# Altium schematic sheet sensorbreakout.schdoc: Core Module
size 431 x 279 mm; DrawnBy: D. Bruey, M. Ciuffo; Organization: Synapse Product Development, LLC.; Address1: 1511 6th Ave., Suite 400; Address2: Seattle, Washington 98101; Address3: 206.381.0898; Address4: www.synapse.com; DocumentNumber: 1; SheetNumber: 1; SheetTotal: 3; PageSetup: Record=PageOptions|CenterHorizontal=True|CenterVertical=True|PrintScale=1.06|XCorrection=1.00|YCorrection=1.00|PrintKind=1|BorderSize=5000000|LeftOffset=0|BottomOffset=0|Orientation=2|PaperLength=4318|PaperWidth=2794|Scale=100|PaperSource=7|PrintQuality=200|MediaType=1|DitherType=10|PrintScaleMode=1|PaperKind=11x17|PaperIndex=3
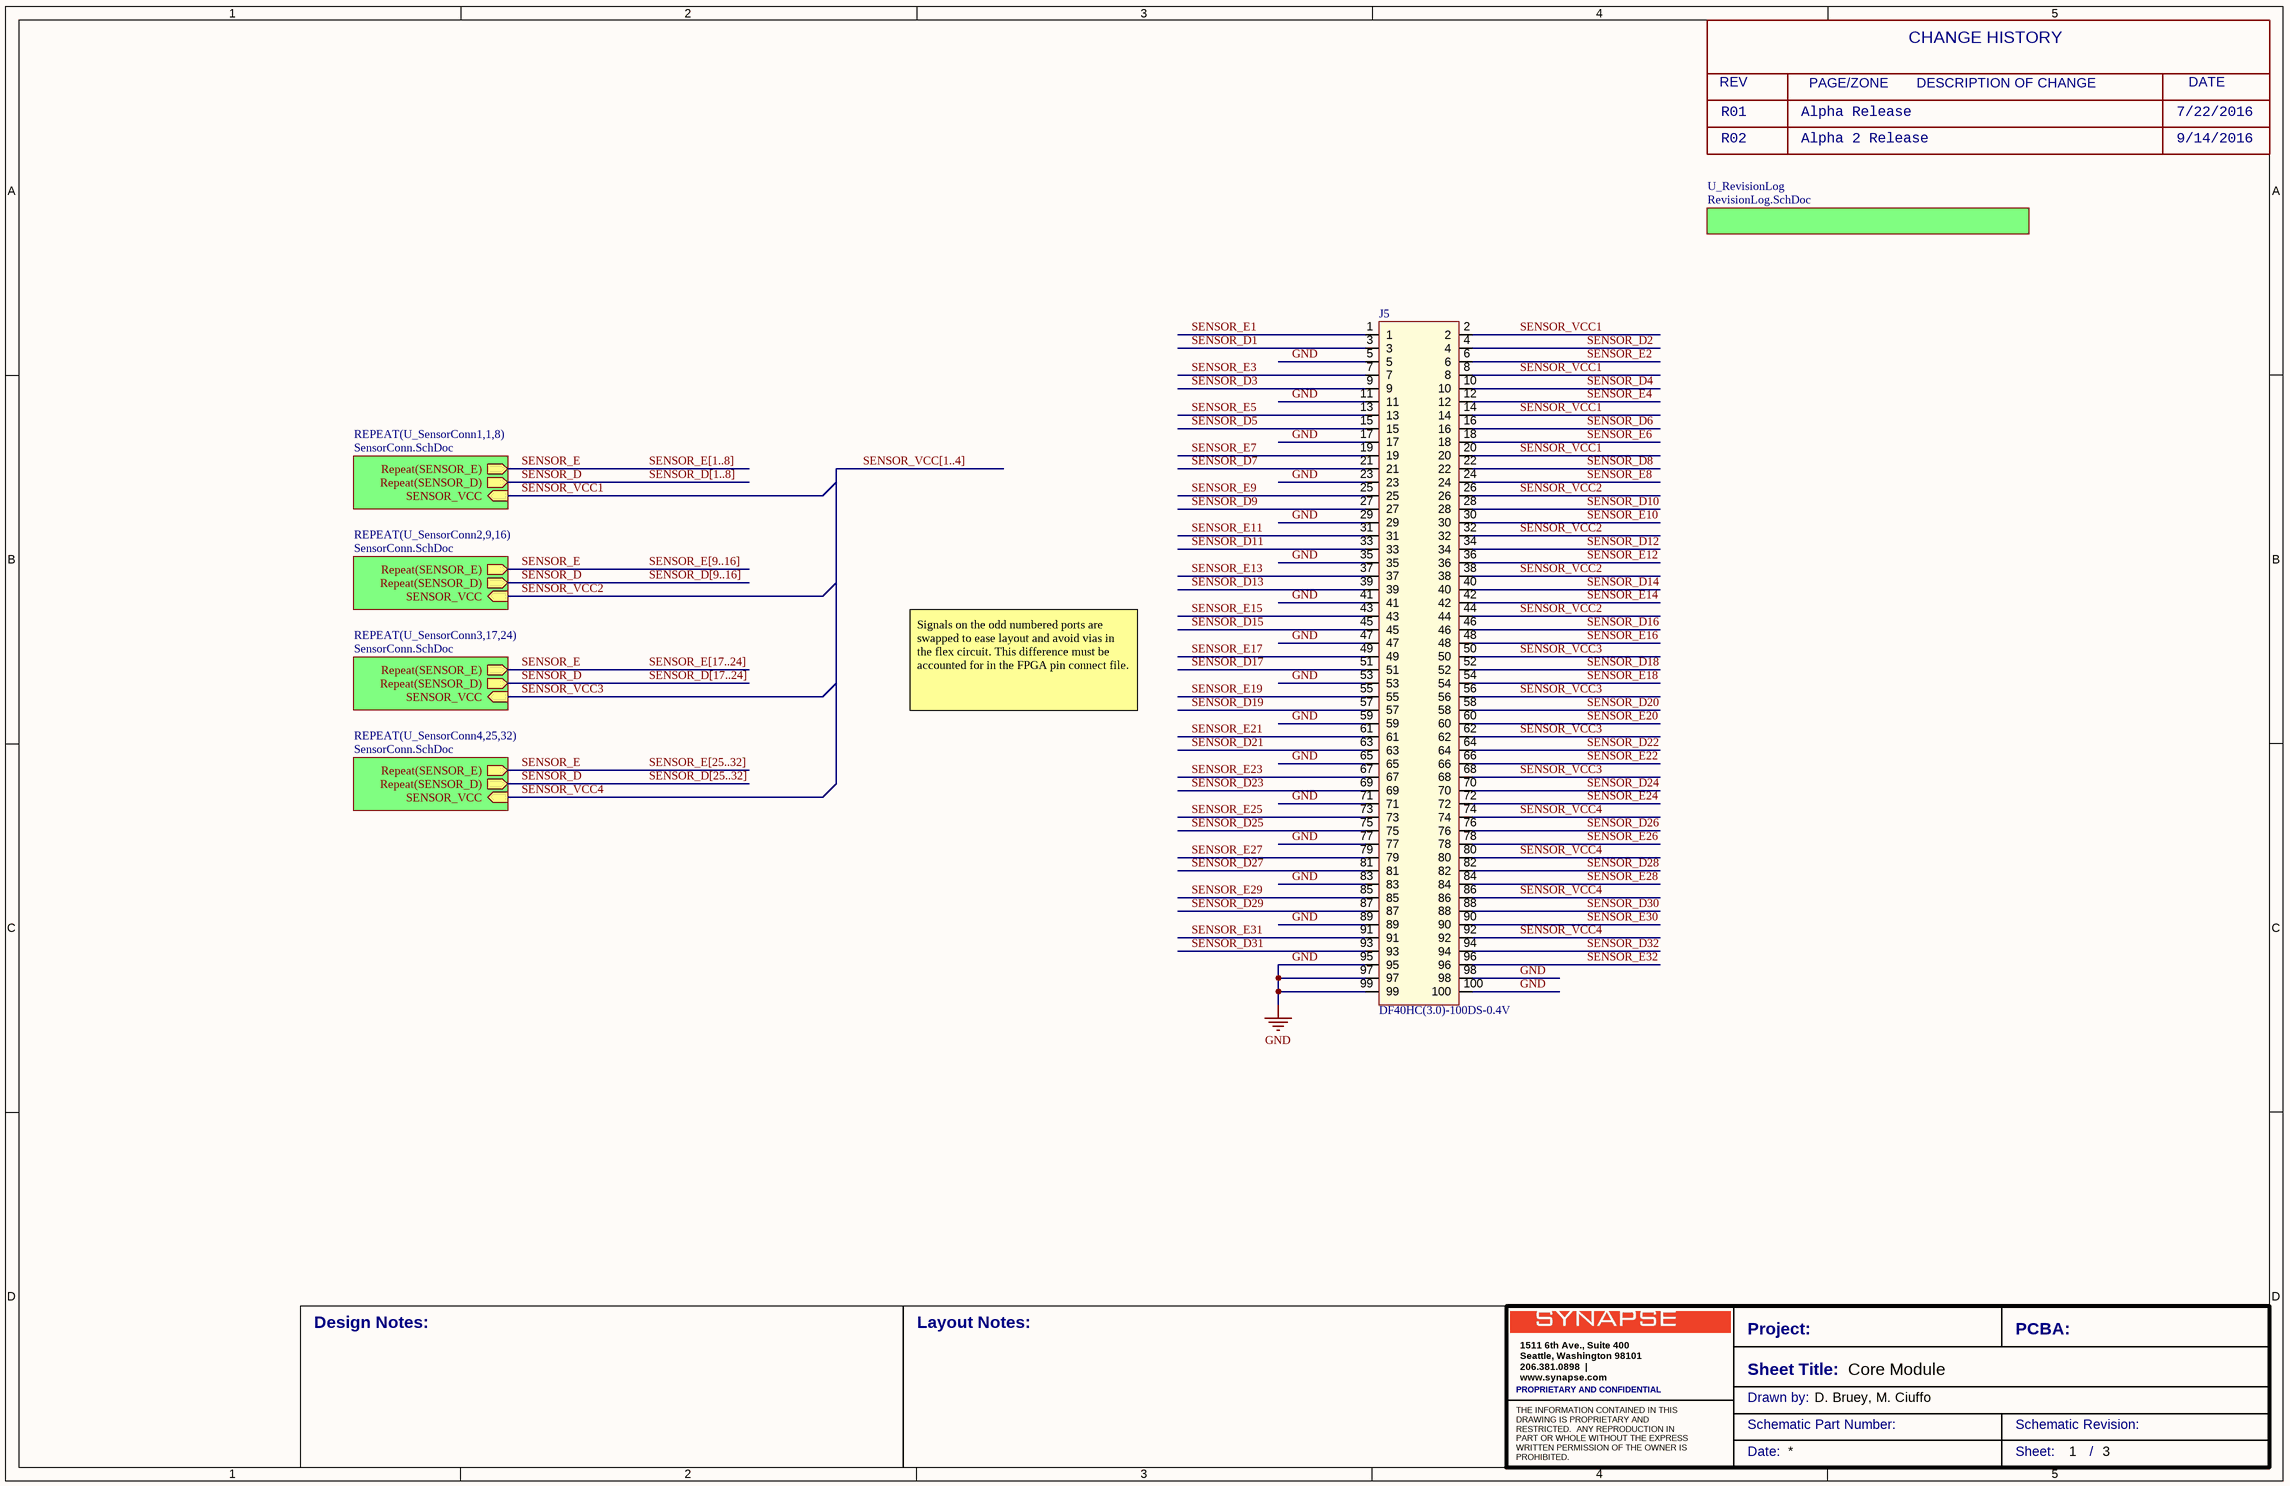
[diagram p0: sensorbreakout.schdoc]

## Parts
J5  DF40HC(3.0)-100DS-0.4V  [con100_hirose-df40c-100ds_129h]

## Sub-sheets
REPEAT(U_SensorConn1,1,8) = SensorConn.SchDoc: Repeat(SENSOR_D), Repeat(SENSOR_E), SENSOR_VCC (in)
REPEAT(U_SensorConn2,9,16) = SensorConn.SchDoc: Repeat(SENSOR_D), Repeat(SENSOR_E), SENSOR_VCC (in)
REPEAT(U_SensorConn3,17,24) = SensorConn.SchDoc: Repeat(SENSOR_D), Repeat(SENSOR_E), SENSOR_VCC (in)
REPEAT(U_SensorConn4,25,32) = SensorConn.SchDoc: Repeat(SENSOR_D), Repeat(SENSOR_E), SENSOR_VCC (in)
U_RevisionLog = RevisionLog.SchDoc: no entries

## Nets
GND: J5.5 J5.11 J5.17 J5.23 J5.29 J5.35 J5.41 J5.47 J5.53 J5.59 J5.65 J5.71 J5.77 J5.83 J5.89 J5.95 J5.97 J5.98 J5.99 J5.100
SENSOR_D: sheet REPEAT(U_SensorConn1,1,8)/Repeat(SENSOR_D), sheet REPEAT(U_SensorConn2,9,16)/Repeat(SENSOR_D), sheet REPEAT(U_SensorConn3,17,24)/Repeat(SENSOR_D), sheet REPEAT(U_SensorConn4,25,32)/Repeat(SENSOR_D)
SENSOR_D1: J5.3
SENSOR_D2: J5.4
SENSOR_D3: J5.9
SENSOR_D4: J5.10
SENSOR_D5: J5.15
SENSOR_D6: J5.16
SENSOR_D7: J5.21
SENSOR_D8: J5.22
SENSOR_D9: J5.27
SENSOR_D10: J5.28
SENSOR_D11: J5.33
SENSOR_D12: J5.34
SENSOR_D13: J5.39
SENSOR_D14: J5.40
SENSOR_D15: J5.45
SENSOR_D16: J5.46
SENSOR_D17: J5.51
SENSOR_D18: J5.52
SENSOR_D19: J5.57
SENSOR_D20: J5.58
SENSOR_D21: J5.63
SENSOR_D22: J5.64
SENSOR_D23: J5.69
SENSOR_D24: J5.70
SENSOR_D25: J5.75
SENSOR_D26: J5.76
SENSOR_D27: J5.81
SENSOR_D28: J5.82
SENSOR_D29: J5.87
SENSOR_D30: J5.88
SENSOR_D31: J5.93
SENSOR_D32: J5.94
SENSOR_E: sheet REPEAT(U_SensorConn1,1,8)/Repeat(SENSOR_E), sheet REPEAT(U_SensorConn2,9,16)/Repeat(SENSOR_E), sheet REPEAT(U_SensorConn3,17,24)/Repeat(SENSOR_E), sheet REPEAT(U_SensorConn4,25,32)/Repeat(SENSOR_E)
SENSOR_E1: J5.1
SENSOR_E2: J5.6
SENSOR_E3: J5.7
SENSOR_E4: J5.12
SENSOR_E5: J5.13
SENSOR_E6: J5.18
SENSOR_E7: J5.19
SENSOR_E8: J5.24
SENSOR_E9: J5.25
SENSOR_E10: J5.30
SENSOR_E11: J5.31
SENSOR_E12: J5.36
SENSOR_E13: J5.37
SENSOR_E14: J5.42
SENSOR_E15: J5.43
SENSOR_E16: J5.48
SENSOR_E17: J5.49
SENSOR_E18: J5.54
SENSOR_E19: J5.55
SENSOR_E20: J5.60
SENSOR_E21: J5.61
SENSOR_E22: J5.66
SENSOR_E23: J5.67
SENSOR_E24: J5.72
SENSOR_E25: J5.73
SENSOR_E26: J5.78
SENSOR_E27: J5.79
SENSOR_E28: J5.84
SENSOR_E29: J5.85
SENSOR_E30: J5.90
SENSOR_E31: J5.91
SENSOR_E32: J5.96
SENSOR_VCC1: J5.2 J5.8 J5.14 J5.20 ; sheet REPEAT(U_SensorConn1,1,8)/SENSOR_VCC
SENSOR_VCC2: J5.26 J5.32 J5.38 J5.44 ; sheet REPEAT(U_SensorConn2,9,16)/SENSOR_VCC
SENSOR_VCC3: J5.50 J5.56 J5.62 J5.68 ; sheet REPEAT(U_SensorConn3,17,24)/SENSOR_VCC
SENSOR_VCC4: J5.74 J5.80 J5.86 J5.92 ; sheet REPEAT(U_SensorConn4,25,32)/SENSOR_VCC

## Buses and harness runs
bus SENSOR_D[1..8]
bus SENSOR_D[9..16]
bus SENSOR_D[17..24]
bus SENSOR_D[25..32]
bus SENSOR_E[1..8]
bus SENSOR_E[9..16]
bus SENSOR_E[17..24]
bus SENSOR_E[25..32]
bus SENSOR_VCC[1..4]

## Notes on the sheet
- REV
- PAGE/ZONE       DESCRIPTION OF CHANGE
- CHANGE HISTORY
- DATE
- R01
- R02
- Alpha Release
- Alpha 2 Release
- 7/22/2016
- 9/14/2016
- Signals on the odd numbered ports are swapped to ease layout and avoid vias in the flex circuit. This difference must be accounted for in the FPGA pin connect file.
- Design Notes:
- Layout Notes:
- Project:
- Sheet Title:
- PCBA:
- PROPRIETARY AND CONFIDENTIAL
- Drawn by:
- Schematic Part Number:
- Schematic Revision:
- Date:
- Sheet:
- /

## Library data of the parts
J5 = DF40HC(3.0)-100DS-0.4V(51): CONN RCPT 100POS 0.4MM SMD GOLD 3.0MM; part_type: connector; id: 1590; mfg: Hirose; dist: Mouser; dist_pn: 798-DF40HC30100DS451; voltage: 30V; positions: 100; TableName: viewAltiumConnectors; mfg_pn: DF40HC(3.0)-100DS-0.4V(51); source_package: DF40HC(3.0)-100DS-0.4V(51); height: 3.0mm; status: Unknown; datasheet: http://www.hirose.co.jp/cataloge_hp/ed_DF40_20140305.pdf